# Altium project ESP32 with USBC.PrjPcb (part 1 of 2)
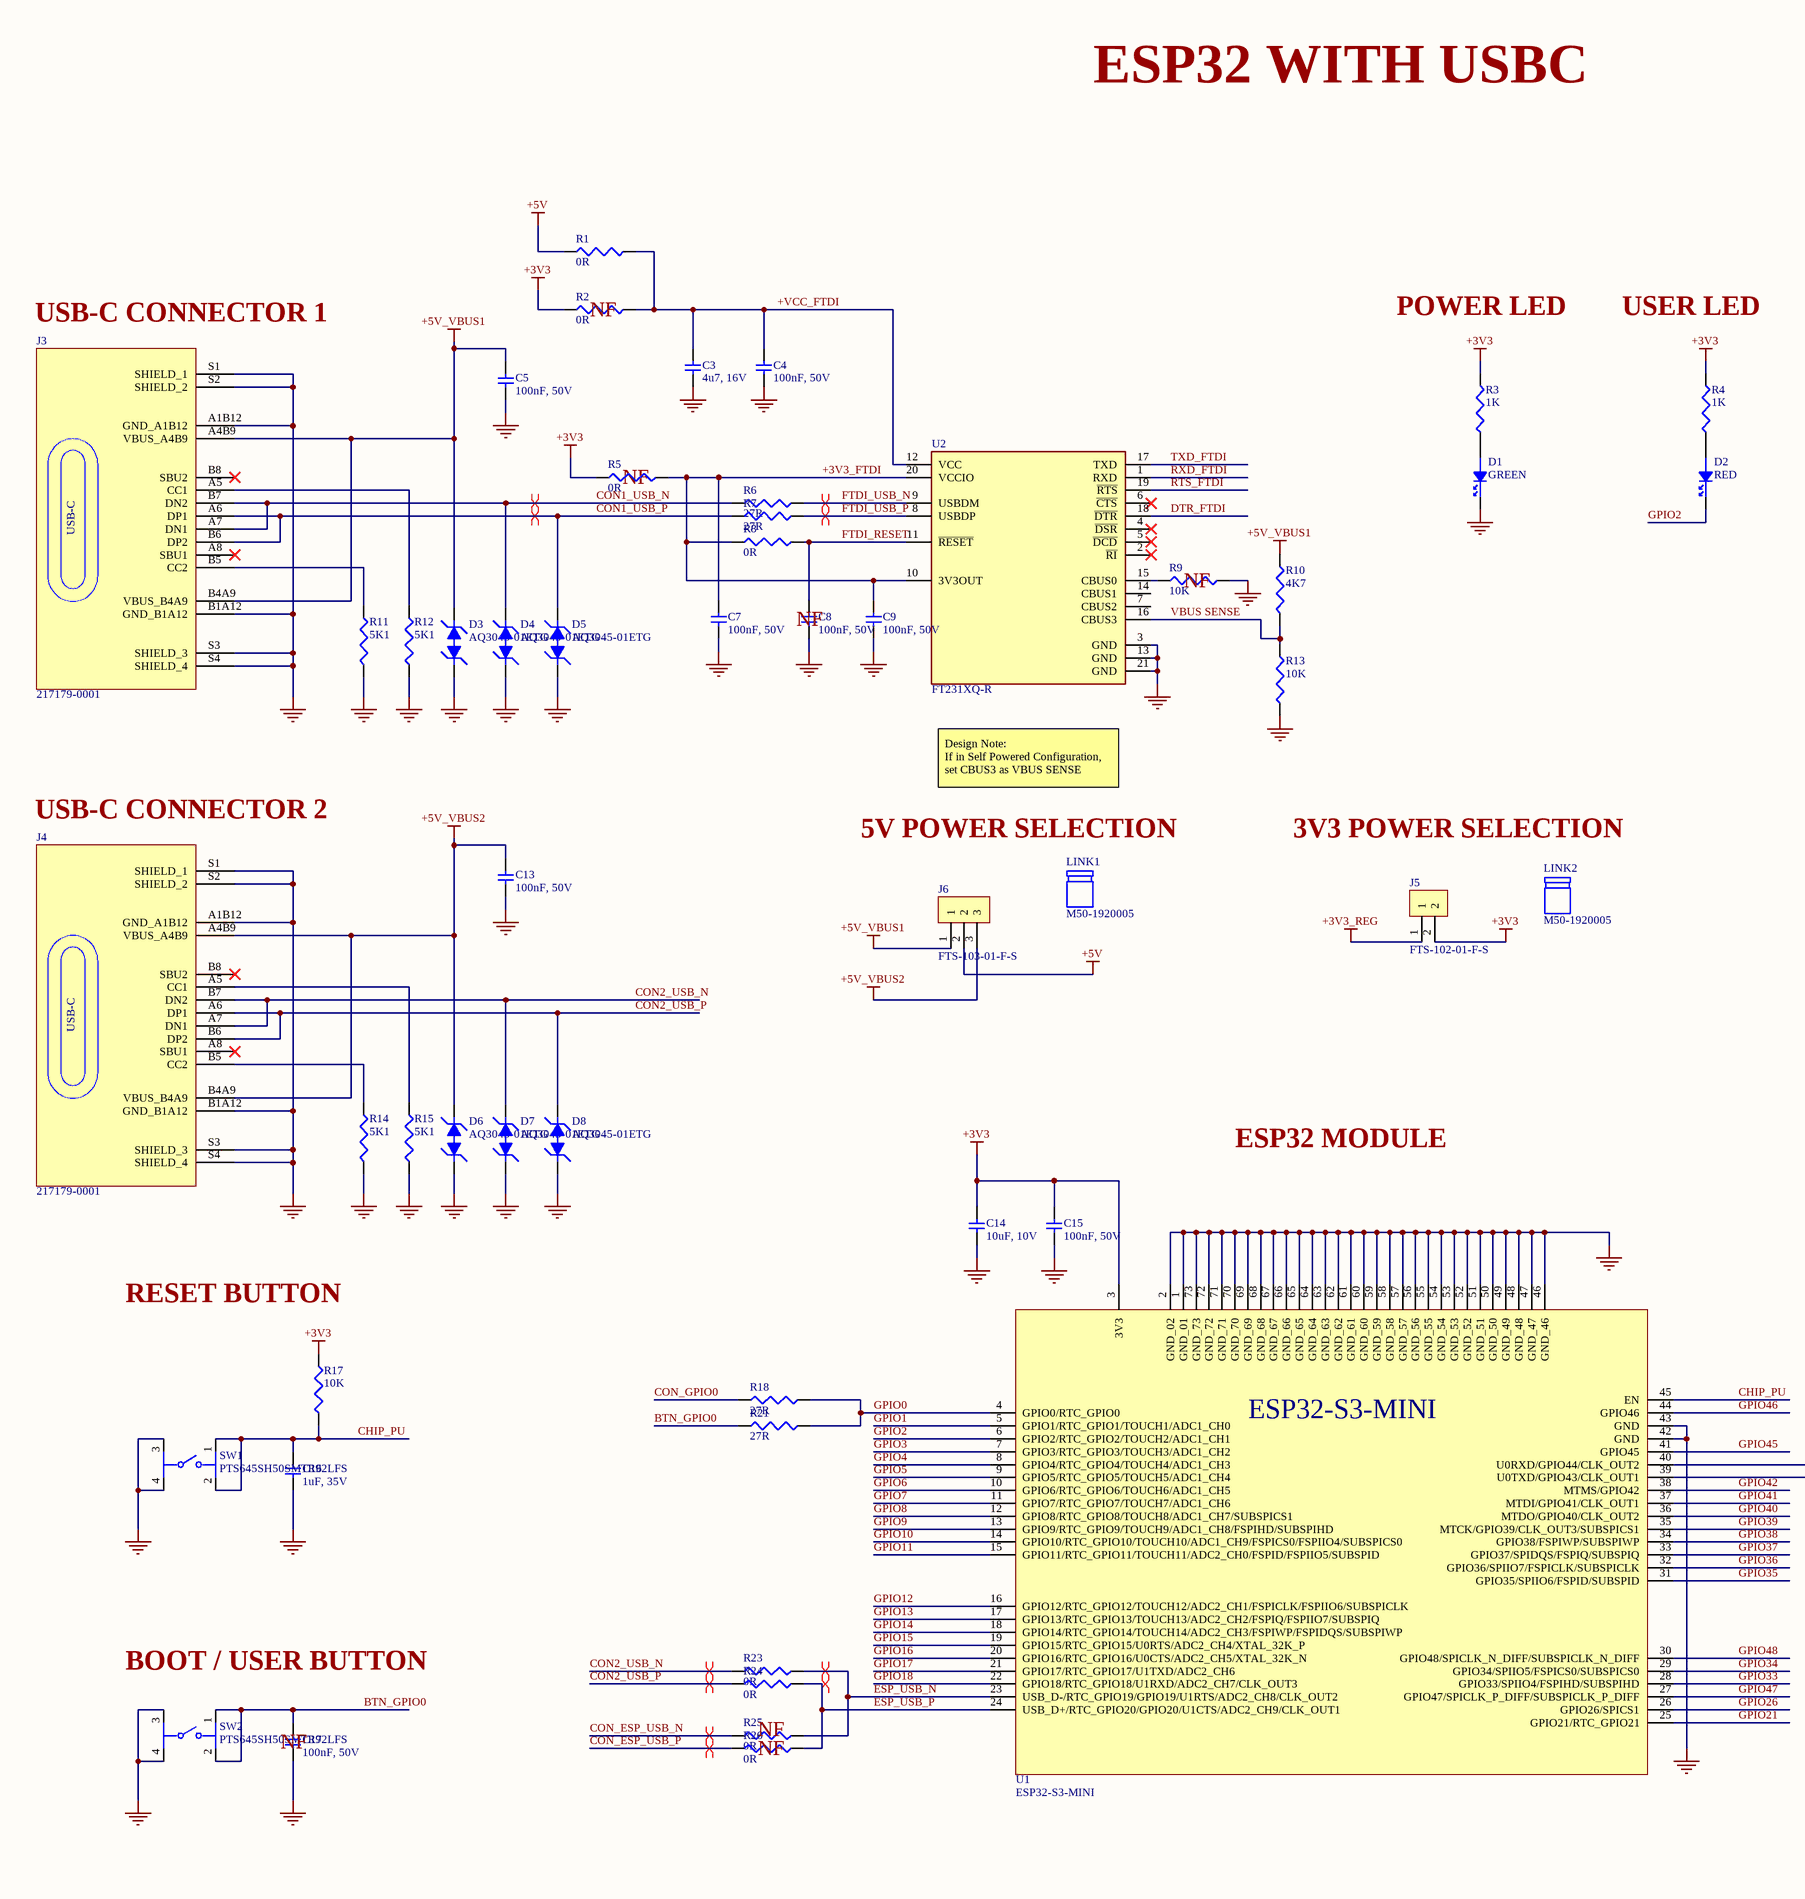
[diagram p0: ESP32 with USBC.SchDoc, left]
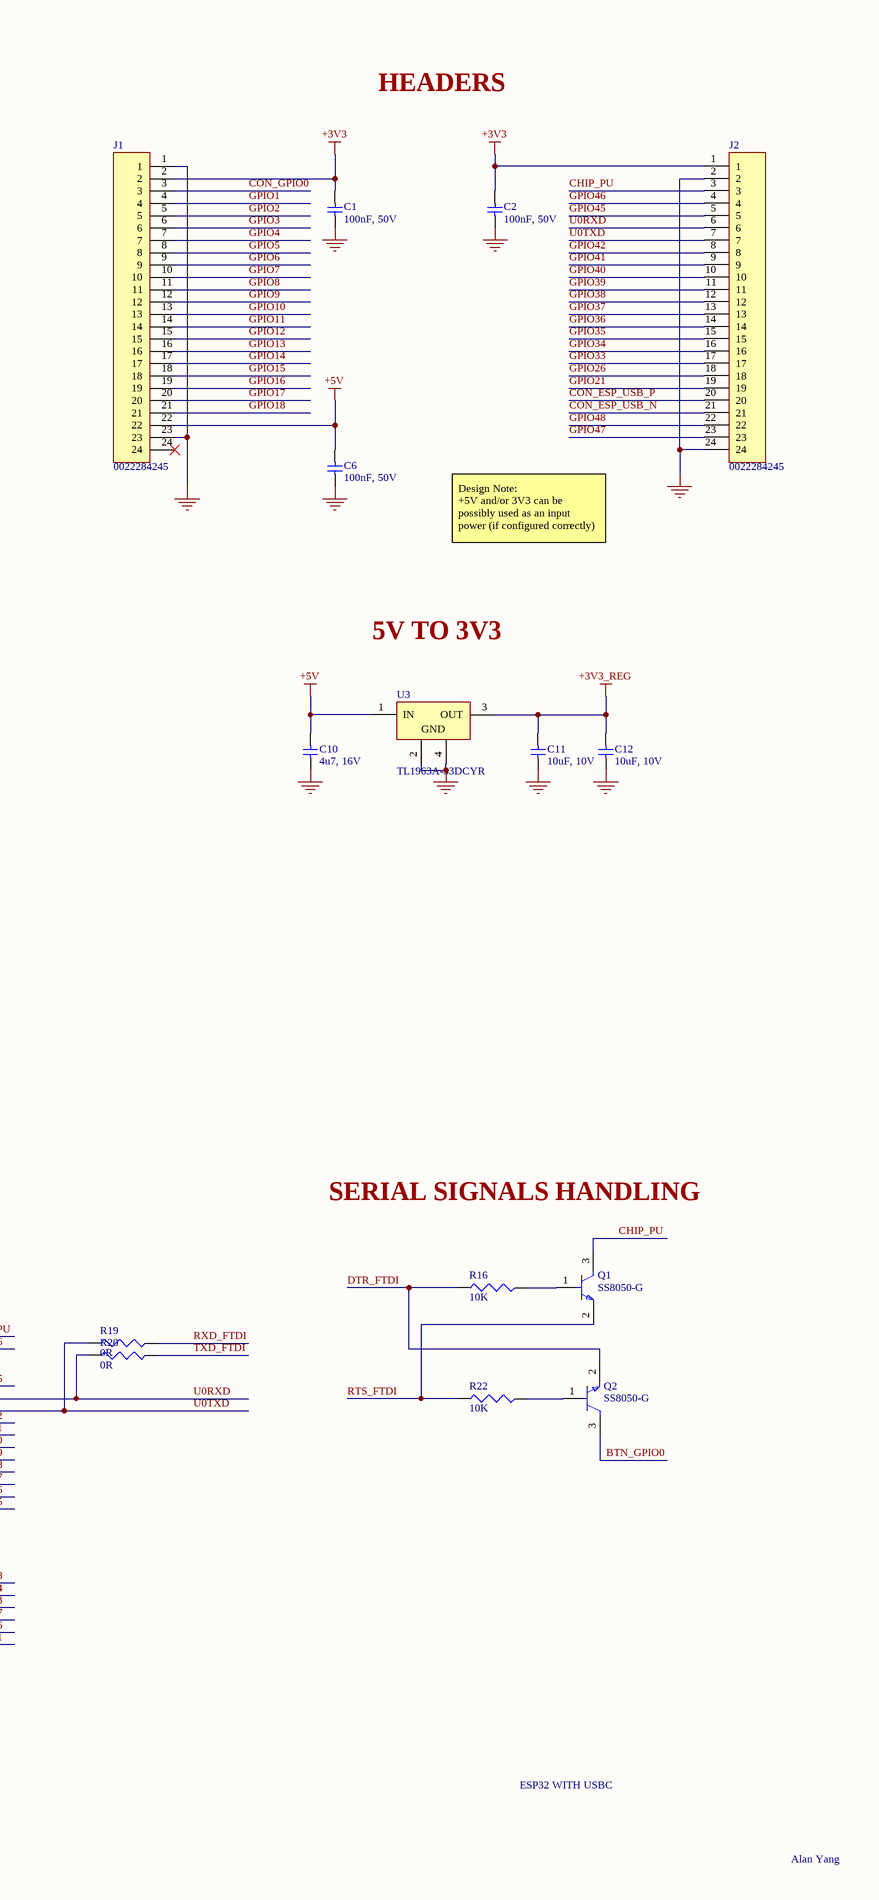
[diagram p1: ESP32 with USBC.SchDoc, right]
1 sheet, 66 parts. Net scope: global (net labels, ports and power ports of the same name join across sheets).
Board file: ESP32 with USBC PCB V1I1.PcbDoc